# EAGLE schematic sr_latch (EAGLE 6.4)
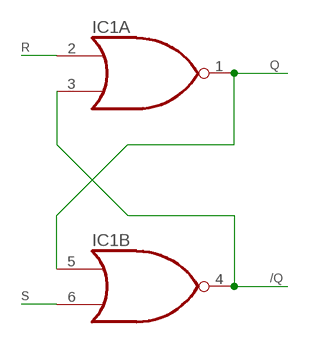
[diagram p0: schematic, sheet 1]

## Parts
IC1  74ALS02D  [SO14]

## Nets
/Q: IC1.3(A:I1) IC1.4(B:O)
Q: IC1.1(A:O) IC1.5(B:I0)
R: IC1.2(A:I0)
S: IC1.6(B:I1)
Unconnected: IC1.8(C:I0) IC1.9(C:I1) IC1.10(C:O) IC1.11(D:I0) IC1.12(D:I1) IC1.13(D:O)

## Power pins joined to a net without a drawn wire
GND: IC1.7(P:GND)
VCC: IC1.14(P:VCC)

## Library data of the parts
IC1 = 74xx-us:74*02: Quad 2-input NOR gate